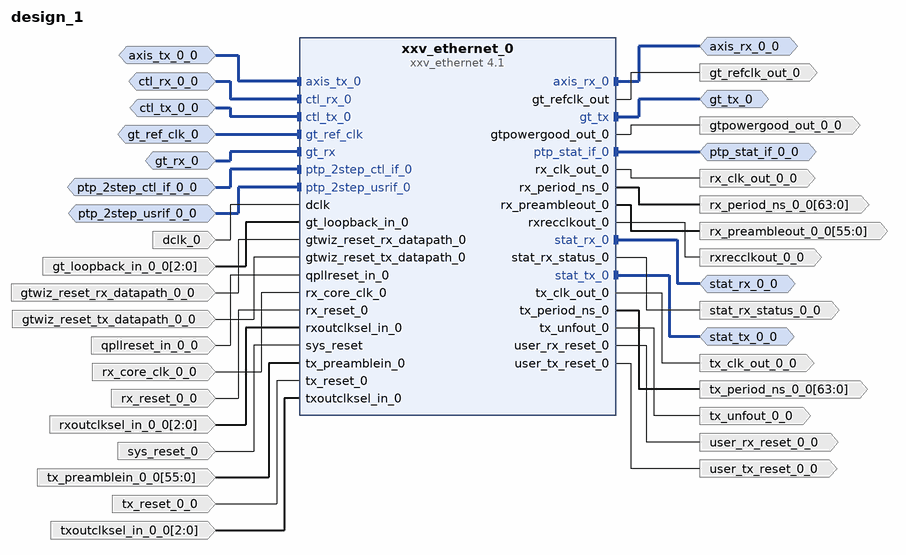
[diagram p0: block diagram of the top level]
# Vivado block design design_1, xczu29dr-ffvf1760-2-i, Vivado 2022.1
create_bd_design design_1

create_bd_intf_port -mode Master -vlnv xilinx.com:interface:axis_rtl:1.0 axis_rx_0_0
set_property -dict {CONFIG.FREQ_HZ 390625000 CONFIG.PHASE 0} [get_bd_intf_ports axis_rx_0_0]
create_bd_intf_port -mode Slave -vlnv xilinx.com:interface:axis_rtl:1.0 axis_tx_0_0
set_property -dict [list \
  CONFIG.HAS_TKEEP 1 \
  CONFIG.HAS_TLAST 1 \
  CONFIG.HAS_TREADY 1 \
  CONFIG.HAS_TSTRB 0 \
  CONFIG.LAYERED_METADATA undef \
  CONFIG.TDATA_NUM_BYTES 8 \
  CONFIG.TDEST_WIDTH 0 \
  CONFIG.TID_WIDTH 0 \
  CONFIG.TUSER_WIDTH 1 \
] [get_bd_intf_ports axis_tx_0_0]
create_bd_intf_port -mode Slave -vlnv xilinx.com:display_xxv_ethernet:ctrl_ports:2.0 ctl_rx_0_0
create_bd_intf_port -mode Slave -vlnv xilinx.com:display_xxv_ethernet:ctrl_ports:2.0 ctl_tx_0_0
create_bd_intf_port -mode Slave -vlnv xilinx.com:interface:diff_clock_rtl:1.0 gt_ref_clk_0
set_property -dict {CONFIG.FREQ_HZ 195312500} [get_bd_intf_ports gt_ref_clk_0]
create_bd_intf_port -mode Slave -vlnv xilinx.com:display_xxv_ethernet:gt_ports:2.0 gt_rx_0
create_bd_intf_port -mode Master -vlnv xilinx.com:display_xxv_ethernet:gt_ports:2.0 gt_tx_0
create_bd_intf_port -mode Slave -vlnv xilinx.com:display_xxv_ethernet:ctrl_ports:2.0 ptp_2step_ctl_if_0_0
create_bd_intf_port -mode Slave -vlnv xilinx.com:display_xxv_ethernet:user_int_ports:2.0 ptp_2step_usrif_0_0
create_bd_intf_port -mode Master -vlnv xilinx.com:display_xxv_ethernet:statistics_ports:2.0 ptp_stat_if_0_0
create_bd_intf_port -mode Master -vlnv xilinx.com:display_xxv_ethernet:statistics_ports:2.0 stat_rx_0_0
create_bd_intf_port -mode Master -vlnv xilinx.com:display_xxv_ethernet:statistics_ports:2.0 stat_tx_0_0
create_bd_port -dir I -type clk dclk_0
create_bd_port -dir I -from 2 -to 0 gt_loopback_in_0_0
create_bd_port -dir O -type clk gt_refclk_out_0
create_bd_port -dir O gtpowergood_out_0_0
create_bd_port -dir I -type rst gtwiz_reset_rx_datapath_0_0
set_property -dict {CONFIG.POLARITY ACTIVE_HIGH} [get_bd_ports gtwiz_reset_rx_datapath_0_0]
create_bd_port -dir I -type rst gtwiz_reset_tx_datapath_0_0
set_property -dict {CONFIG.POLARITY ACTIVE_HIGH} [get_bd_ports gtwiz_reset_tx_datapath_0_0]
create_bd_port -dir I -type rst qpllreset_in_0_0
set_property -dict {CONFIG.POLARITY ACTIVE_HIGH} [get_bd_ports qpllreset_in_0_0]
create_bd_port -dir O -type clk rx_clk_out_0_0
create_bd_port -dir I -type clk rx_core_clk_0_0
set_property -dict {CONFIG.FREQ_HZ 390625000 CONFIG.PHASE 0} [get_bd_ports rx_core_clk_0_0]
create_bd_port -dir O -from 63 -to 0 rx_period_ns_0_0
create_bd_port -dir O -from 55 -to 0 rx_preambleout_0_0
create_bd_port -dir I -type rst rx_reset_0_0
set_property -dict {CONFIG.POLARITY ACTIVE_HIGH} [get_bd_ports rx_reset_0_0]
create_bd_port -dir I -from 2 -to 0 rxoutclksel_in_0_0
create_bd_port -dir O -type clk rxrecclkout_0_0
create_bd_port -dir O stat_rx_status_0_0
create_bd_port -dir I -type rst sys_reset_0
set_property -dict {CONFIG.POLARITY ACTIVE_HIGH} [get_bd_ports sys_reset_0]
create_bd_port -dir O -type clk tx_clk_out_0_0
create_bd_port -dir O -from 63 -to 0 tx_period_ns_0_0
create_bd_port -dir I -from 55 -to 0 tx_preamblein_0_0
create_bd_port -dir I -type rst tx_reset_0_0
set_property -dict {CONFIG.POLARITY ACTIVE_HIGH} [get_bd_ports tx_reset_0_0]
create_bd_port -dir O tx_unfout_0_0
create_bd_port -dir I -from 2 -to 0 txoutclksel_in_0_0
create_bd_port -dir O -type rst user_rx_reset_0_0
create_bd_port -dir O -type rst user_tx_reset_0_0

create_bd_cell -type ip -vlnv xilinx.com:ip:xxv_ethernet:4.1 xxv_ethernet_0
set_property -dict [list \
  CONFIG.BASE_R_KR BASE-R \
  CONFIG.ENABLE_TIME_STAMPING 1 \
  CONFIG.GT_REF_CLK_FREQ 195.3125 \
] [get_bd_cells xxv_ethernet_0]

# ---- connections ----

connect_bd_intf_net -intf_net axis_tx_0_0_1 [get_bd_intf_ports axis_tx_0_0] [get_bd_intf_pins xxv_ethernet_0/axis_tx_0]
connect_bd_intf_net -intf_net ctl_rx_0_0_1 [get_bd_intf_ports ctl_rx_0_0] [get_bd_intf_pins xxv_ethernet_0/ctl_rx_0]
connect_bd_intf_net -intf_net ctl_tx_0_0_1 [get_bd_intf_ports ctl_tx_0_0] [get_bd_intf_pins xxv_ethernet_0/ctl_tx_0]
connect_bd_intf_net -intf_net gt_ref_clk_0_1 [get_bd_intf_ports gt_ref_clk_0] [get_bd_intf_pins xxv_ethernet_0/gt_ref_clk]
connect_bd_intf_net -intf_net gt_rx_0_1 [get_bd_intf_ports gt_rx_0] [get_bd_intf_pins xxv_ethernet_0/gt_rx]
connect_bd_intf_net -intf_net ptp_2step_ctl_if_0_0_1 [get_bd_intf_ports ptp_2step_ctl_if_0_0] [get_bd_intf_pins xxv_ethernet_0/ptp_2step_ctl_if_0]
connect_bd_intf_net -intf_net ptp_2step_usrif_0_0_1 [get_bd_intf_ports ptp_2step_usrif_0_0] [get_bd_intf_pins xxv_ethernet_0/ptp_2step_usrif_0]
connect_bd_intf_net [get_bd_intf_ports axis_rx_0_0] [get_bd_intf_pins xxv_ethernet_0/axis_rx_0]
connect_bd_intf_net [get_bd_intf_ports gt_tx_0] [get_bd_intf_pins xxv_ethernet_0/gt_tx]
connect_bd_intf_net [get_bd_intf_ports ptp_stat_if_0_0] [get_bd_intf_pins xxv_ethernet_0/ptp_stat_if_0]
connect_bd_intf_net [get_bd_intf_ports stat_rx_0_0] [get_bd_intf_pins xxv_ethernet_0/stat_rx_0]
connect_bd_intf_net [get_bd_intf_ports stat_tx_0_0] [get_bd_intf_pins xxv_ethernet_0/stat_tx_0]
connect_bd_net -net dclk_0_1 [get_bd_ports dclk_0] [get_bd_pins xxv_ethernet_0/dclk]
connect_bd_net -net gt_loopback_in_0_0_1 [get_bd_ports gt_loopback_in_0_0] [get_bd_pins xxv_ethernet_0/gt_loopback_in_0]
connect_bd_net -net gtwiz_reset_rx_datapath_0_0_1 [get_bd_ports gtwiz_reset_rx_datapath_0_0] [get_bd_pins xxv_ethernet_0/gtwiz_reset_rx_datapath_0]
connect_bd_net -net gtwiz_reset_tx_datapath_0_0_1 [get_bd_ports gtwiz_reset_tx_datapath_0_0] [get_bd_pins xxv_ethernet_0/gtwiz_reset_tx_datapath_0]
connect_bd_net -net qpllreset_in_0_0_1 [get_bd_ports qpllreset_in_0_0] [get_bd_pins xxv_ethernet_0/qpllreset_in_0]
connect_bd_net -net rx_core_clk_0_0_1 [get_bd_ports rx_core_clk_0_0] [get_bd_pins xxv_ethernet_0/rx_core_clk_0]
connect_bd_net -net rx_reset_0_0_1 [get_bd_ports rx_reset_0_0] [get_bd_pins xxv_ethernet_0/rx_reset_0]
connect_bd_net -net rxoutclksel_in_0_0_1 [get_bd_ports rxoutclksel_in_0_0] [get_bd_pins xxv_ethernet_0/rxoutclksel_in_0]
connect_bd_net -net sys_reset_0_1 [get_bd_ports sys_reset_0] [get_bd_pins xxv_ethernet_0/sys_reset]
connect_bd_net -net tx_preamblein_0_0_1 [get_bd_ports tx_preamblein_0_0] [get_bd_pins xxv_ethernet_0/tx_preamblein_0]
connect_bd_net -net tx_reset_0_0_1 [get_bd_ports tx_reset_0_0] [get_bd_pins xxv_ethernet_0/tx_reset_0]
connect_bd_net -net txoutclksel_in_0_0_1 [get_bd_ports txoutclksel_in_0_0] [get_bd_pins xxv_ethernet_0/txoutclksel_in_0]
connect_bd_net [get_bd_pins xxv_ethernet_0/gt_refclk_out] [get_bd_ports gt_refclk_out_0]
connect_bd_net [get_bd_pins xxv_ethernet_0/gtpowergood_out_0] [get_bd_ports gtpowergood_out_0_0]
connect_bd_net [get_bd_pins xxv_ethernet_0/rx_clk_out_0] [get_bd_ports rx_clk_out_0_0]
connect_bd_net [get_bd_pins xxv_ethernet_0/rx_period_ns_0] [get_bd_ports rx_period_ns_0_0]
connect_bd_net [get_bd_pins xxv_ethernet_0/rx_preambleout_0] [get_bd_ports rx_preambleout_0_0]
connect_bd_net [get_bd_pins xxv_ethernet_0/rxrecclkout_0] [get_bd_ports rxrecclkout_0_0]
connect_bd_net [get_bd_pins xxv_ethernet_0/stat_rx_status_0] [get_bd_ports stat_rx_status_0_0]
connect_bd_net [get_bd_pins xxv_ethernet_0/tx_clk_out_0] [get_bd_ports tx_clk_out_0_0]
connect_bd_net [get_bd_pins xxv_ethernet_0/tx_period_ns_0] [get_bd_ports tx_period_ns_0_0]
connect_bd_net [get_bd_pins xxv_ethernet_0/tx_unfout_0] [get_bd_ports tx_unfout_0_0]
connect_bd_net [get_bd_pins xxv_ethernet_0/user_rx_reset_0] [get_bd_ports user_rx_reset_0_0]
connect_bd_net [get_bd_pins xxv_ethernet_0/user_tx_reset_0] [get_bd_ports user_tx_reset_0_0]

validate_bd_design
save_bd_design
